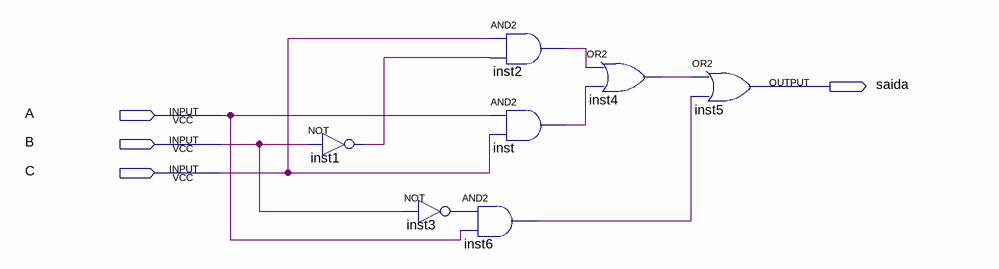
[diagram p0: schematic sheet]
// Quartus schematic comp_normal.bdf as structural Verilog: 7 symbols, 4 pins
module comp_normal (
  input  A,
  input  B,
  input  C,
  output saida
);

  wire inst1_out, inst2_out, inst3_out, inst4_out, inst6_out, inst_out;

  not inst1 (inst1_out, B);
  not inst3 (inst3_out, B);
  and inst2 (inst2_out, C, inst1_out);
  and inst (inst_out, A, C);
  and inst6 (inst6_out, inst3_out, A);
  or inst4 (inst4_out, inst2_out, inst_out);
  or inst5 (saida, inst4_out, inst6_out);
endmodule
